# EAGLE schematic eCog111_16ch_PWM_Servo (EAGLE 6.6.0)
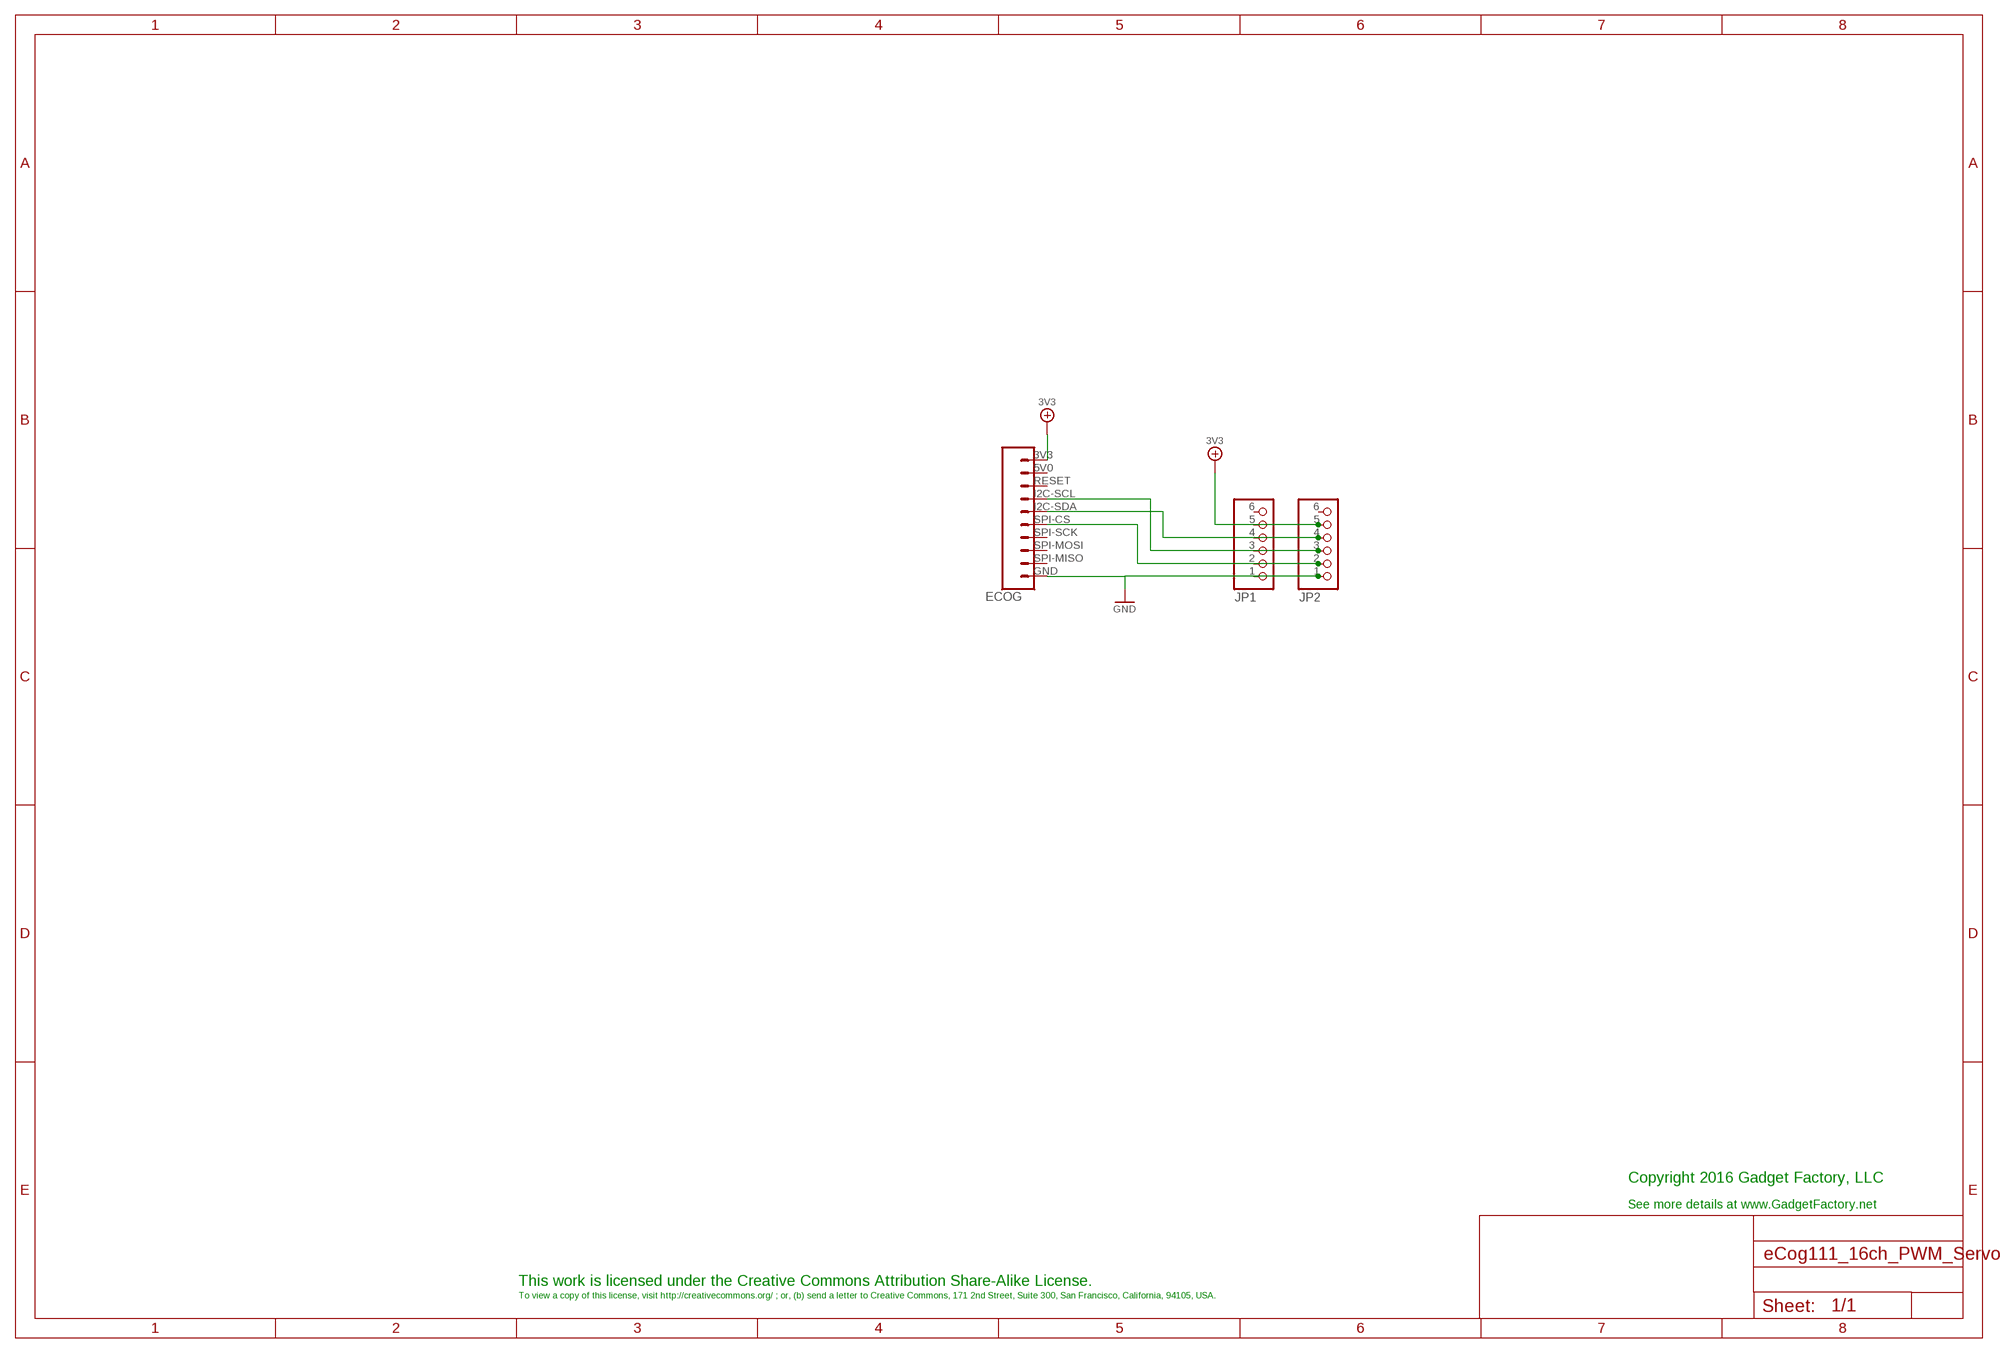
[diagram p0: schematic, sheet 1]

## Parts
ECOG  ECOG_BUSES_ROWECOG_BUSES_SMD  [ECOG_BUSES_SMD]
JP1  PINHD-1X6  [1X06]
JP2  PINHD-1X6  [1X06]

## Nets
3V3: ECOG.3V3 JP1.5 JP2.5
GND: ECOG.GND JP1.1 JP2.1
N$1: ECOG.SPI-CS JP1.2 JP2.2
N$2: ECOG.I2C-SCL JP1.3 JP2.3
N$3: ECOG.I2C-SDA JP1.4 JP2.4
Unconnected: ECOG.5V0 ECOG.RESET ECOG.SPI-MISO ECOG.SPI-MOSI ECOG.SPI-SCK JP1.6 JP2.6

## Notes on the sheet
- Copyright 2016 Gadget Factory, LLC
- See more details at www.GadgetFactory.net
- This work is licensed under the Creative Commons Attribution Share-Alike License.
- To view a copy of this license, visit http://creativecommons.org/ ; or, (b) send a letter to Creative Commons, 171 2nd Street, Suite 300, San Francisco, California, 94105, USA.

## Library data of the parts
ECOG = eCogs:ECOG_BUSES_ROW; DIGIKEY: S1013EC-10-ND
JP1 JP2 = GadgetFactory:PINHD-1X6: PIN HEADER